# EAGLE design Grove - Line Finder (EAGLE 5.10)
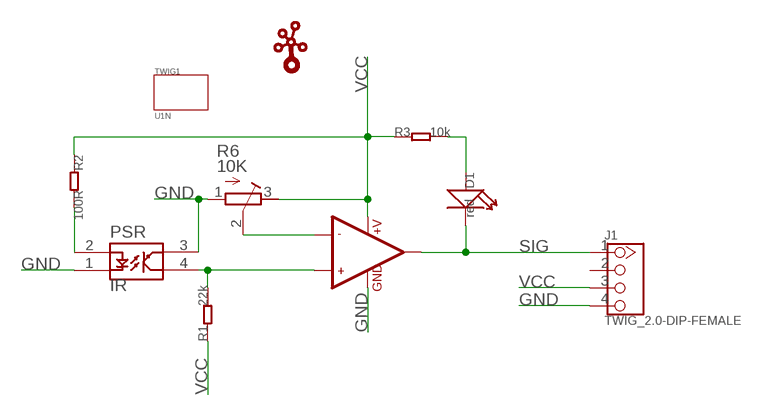
[diagram p0: schematic, sheet 1]

## Parts
D1  red  007-LED35*40  [LED0603]
J1  TWIG_2.0-DIP-FEMALE  [2.0_1X4]
PSR  PSR  [PSR]
R1  22k  005-R0603_S  [0603_S]
R2  100R  005-R0603_S  [0603_S]
R3  10k  005-R0603_S  [0603_S]
R6  10K  R-TRIMM3214W  [RTRIM3214W]
TWIG1  U1N  [U1N]
U1  002-LMV358  [SO08]
U$2  TWIGLOGOTWIGLOGO_SMALL  [TWIGLOGO_SMALL]

## Nets
GND: J1.4 PSR.1 PSR.3 R6.1(E) U1.4(GND)
N$1: R6.2(S) U1.2(-IN1)
N$2: PSR.4 R1.2 U1.3(+IN1)
N$5: PSR.2 R2.2
N$12: D1.1(+) R3.2
SIG: D1.2(-) J1.1 U1.1(OUT1)
VCC: J1.3 R1.1 R2.1 R3.1 R6.3(A) U1.8(+V)
Unconnected: J1.2 U1.5(+IN2) U1.6(-IN2) U1.7(OUT2)

## Library data of the parts
D1 = Discrete:007-LED*
J1 = Connector:TWIG_2.0-DIP-FEMALE
PSR = IR:PSR*
R1-R3 = Discrete:005-R*
R6 = rcl:R-TRIMM: Trimm resistor
TWIG1 = EXT_moudle:U1N
U1 = ICs:002-LMV358
U$2 = seeedleo:TWIGLOGO

## Board
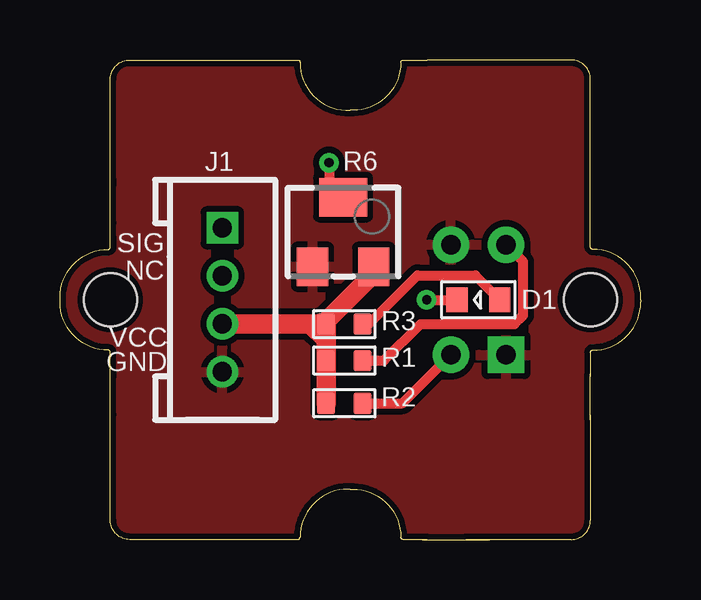
[diagram p1: board, top side]
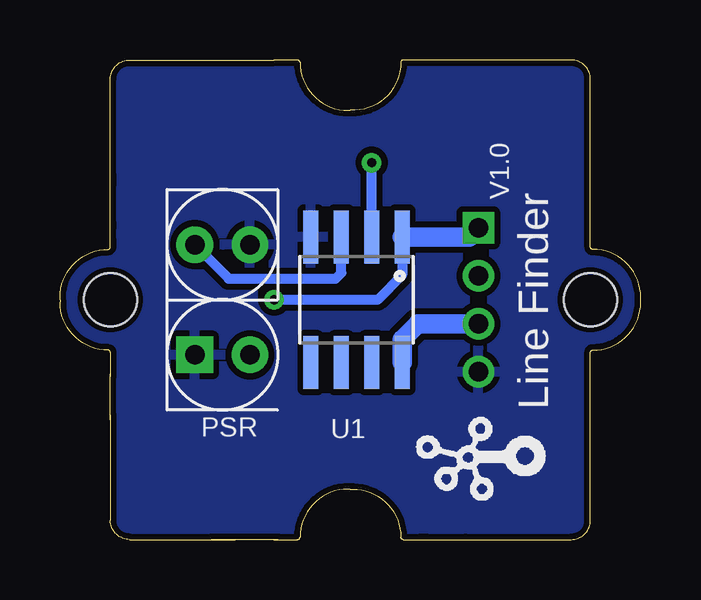
[diagram p2: board, bottom side, seen from below]

Size 24.2 x 20 mm. Coordinates in mm from the lower left corner, seen from the top.
Copper layers (1*16): Top 0.035mm / dielectric 1.5mm / Bottom 0.035mm
Design rules "SeeedStudio_rule_no_angle_090911 *": minimum track width 6mil, minimum drill 12mil, track to track 6mil, track to pad 6mil, pad to pad 6mil, via to via 6mil, smd to smd 0mil, copper to edge 10mil, drill to drill 10mil, minimum pad ring 10mil, minimum via ring 6mil, stop-mask expansion 2mil, vias tented up to drill 100mil, thermal gap 10mil

### Footprints (pad centres in the part's own frame; a part is rotated, then mirrored left to right if it is on the bottom)
LED0603 = smd 0.889 x 1.016: 1 -0.889,0; 2 0.889,0
2.0_1X4 = drill 0.8 pad 1.27 square: 1 -3,0 | drill 0.8 pad 1.27 round: 2 -1,0; 3 1,0; 4 3,0
PSR = drill 0.813 pad 1.524 square: 1 -2.3,1.15 | drill 0.813 pad 1.524 round: 2 -2.3,-1.15; 3 2.3,-1.15; 4 2.3,1.15
0603_S = smd 0.762 x 0.889: 1 -0.762,0; 2 0.762,0
RTRIM3214W = smd 1.3 x 1.6: 1 -1.275,-1.45; 3 1.275,-1.45 | smd 2 x 1.6: 2 0,1.45
U1N = hole 2.2: 0,-10; 0,10
SO08 = smd 0.61 x 2.21: 1 -1.905,-2.616; 2 -0.635,-2.616; 3 0.635,-2.616; 4 1.905,-2.616; 5 1.905,2.616; 6 0.635,2.616; 7 -0.635,2.616; 8 -1.905,2.616

### Placement (x,y rotation side)
D1  17.43,10 180 top
J1  6.77,10 270 top
PSR  17.43,10 90 bottom
R1  11.85,7.46 0 top
R2  11.85,5.68 0 top
R3  11.85,8.98 0 top
R6  11.8,12.83 0 top
TWIG1  12.1,10 90 top
U1  11.85,10 180 bottom
U$2  3.84,1.24 90 bottom

### Tracks (layer width: path | path; a pad name or v marks a point on that pad's centre or on a via)
GND
  pour Bottom: -13.05,14.19 -11.14,14.19 -11.14,11.65 -13.05,11.65
  pour Top (isolate 0.254): -0.73,21.43 -0.85,21.43 -0.85,-0.41 24.29,-0.41 24.29,21.43
  pour Bottom (isolate 0.254): 24.29,21.43 -0.85,21.43 -0.85,-0.41 24.29,-0.41
N$1  (via drill 0.38 pad 0.81)
  Top 0.406: v11.21,15.71 11.21,14.87 R6.2
  Bottom 0.406: U1.2 v11.21,15.71
N$2
  Top 0.406: R1.2 13.5,7.46 15.02,8.98 18.93,8.98 19.29,9.35 19.29,11.59 PSR.4
  Bottom 0.406: U1.3 12.48,11.12 12.72,10.89 17.17,10.89 PSR.4
N$5
  Top 0.406: R2.2 14.27,5.68 PSR.2
N$12
  Top 0.406: R3.2 12.86,8.98 14.89,11.02 17.31,11.02 D1.1
SIG  (via drill 0.38 pad 0.81)
  Top 0.406: v15.27,10 D1.2
  Bottom 0.406: U1.1 9.94,11.02 10.96,10 v15.27,10
  Bottom 0.813: U1.1 7.15,12.62 J1.1
VCC
  Top 0.813: R2.1 R1.1 11.08,7.84 11.08,8.35 | 11.08,8.35 R3.1 | 10.43,9 11.07,9 R3.1 | R3.1 11.08,9.11 13.07,11.1 R6.3 | J1.3 10.43,9 | 10.43,9 11.08,8.35
  Bottom 0.813: J1.3 9.29,9 9.94,8.35 U1.8

### Text on the board
tPlace: SIG | NC | VCC | GND
bPlace: V1.0 | Line Finder